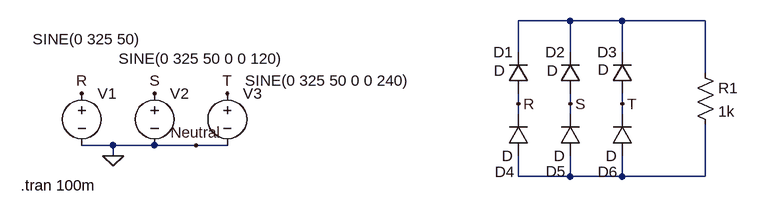
[diagram p0: schematic ThreePhaseRectifier.asc]
ThreePhaseRectifier.asc, the LTspice schematic file:
Version 4
SHEET 1 880 680
WIRE 176 64 96 64
WIRE 256 64 176 64
WIRE 384 64 256 64
WIRE 96 112 96 64
WIRE 176 112 176 64
WIRE 256 112 256 64
WIRE 384 144 384 64
WIRE 96 192 96 176
WIRE 176 192 176 176
WIRE 256 192 256 176
WIRE 96 208 96 192
WIRE 176 208 176 192
WIRE 256 208 256 192
WIRE -528 256 -576 256
WIRE -464 256 -528 256
WIRE -400 256 -464 256
WIRE -352 256 -400 256
WIRE -528 272 -528 256
WIRE 96 304 96 272
WIRE 176 304 176 272
WIRE 176 304 96 304
WIRE 256 304 256 272
WIRE 256 304 176 304
WIRE 384 304 384 224
WIRE 384 304 256 304
FLAG 96 192 R
FLAG 176 192 S
FLAG 256 192 T
FLAG -576 176 R
FLAG -464 176 S
FLAG -352 176 T
FLAG -400 256 Neutral
FLAG -528 272 0
SYMBOL diode 112 176 R180
WINDOW 0 24 64 Left 2
WINDOW 3 36 35 Left 2
SYMATTR InstName D1
SYMBOL diode 192 176 R180
WINDOW 0 24 64 Left 2
WINDOW 3 35 35 Left 2
SYMATTR InstName D2
SYMBOL diode 272 176 R180
WINDOW 0 24 64 Left 2
WINDOW 3 36 37 Left 2
SYMATTR InstName D3
SYMBOL diode 112 272 R180
WINDOW 0 21 -25 Left 2
WINDOW 3 24 0 Left 2
SYMATTR InstName D4
SYMBOL diode 192 272 R180
WINDOW 0 23 -24 Left 2
WINDOW 3 24 0 Left 2
SYMATTR InstName D5
SYMBOL diode 272 272 R180
WINDOW 0 23 -25 Left 2
WINDOW 3 24 0 Left 2
SYMATTR InstName D6
SYMBOL voltage -576 160 R0
WINDOW 3 -76 -68 Left 2
WINDOW 123 0 0 Left 2
WINDOW 39 0 0 Left 2
SYMATTR InstName V1
SYMATTR Value SINE(0 325 50)
SYMBOL voltage -464 160 R0
WINDOW 3 -55 -38 Left 2
WINDOW 123 0 0 Left 2
WINDOW 39 0 0 Left 2
SYMATTR InstName V2
SYMATTR Value SINE(0 325 50 0 0 120)
SYMBOL voltage -352 160 R0
WINDOW 3 27 -4 Left 2
WINDOW 123 0 0 Left 2
WINDOW 39 0 0 Left 2
SYMATTR InstName V3
SYMATTR Value SINE(0 325 50 0 0 240)
SYMBOL res 368 128 R0
SYMATTR InstName R1
SYMATTR Value 1k
TEXT -670 318 Left 2 !.tran 100m

The netlist it stands for:
* ThreePhaseRectifier.asc
D1 R N001 D
D2 S N001 D
D3 T N001 D
D4 N002 R D
D5 N002 S D
D6 N002 T D
V1 R 0 SINE(0 325 50)
V2 S 0 SINE(0 325 50 0 0 120)
V3 T 0 SINE(0 325 50 0 0 240)
R1 N001 N002 1k
.model D D
.lib standard.dio
.tran 100m
.backanno
.end